# EasyEDA Pro project ProPrj_STM32音响_2025-06-08.epro, board First Test
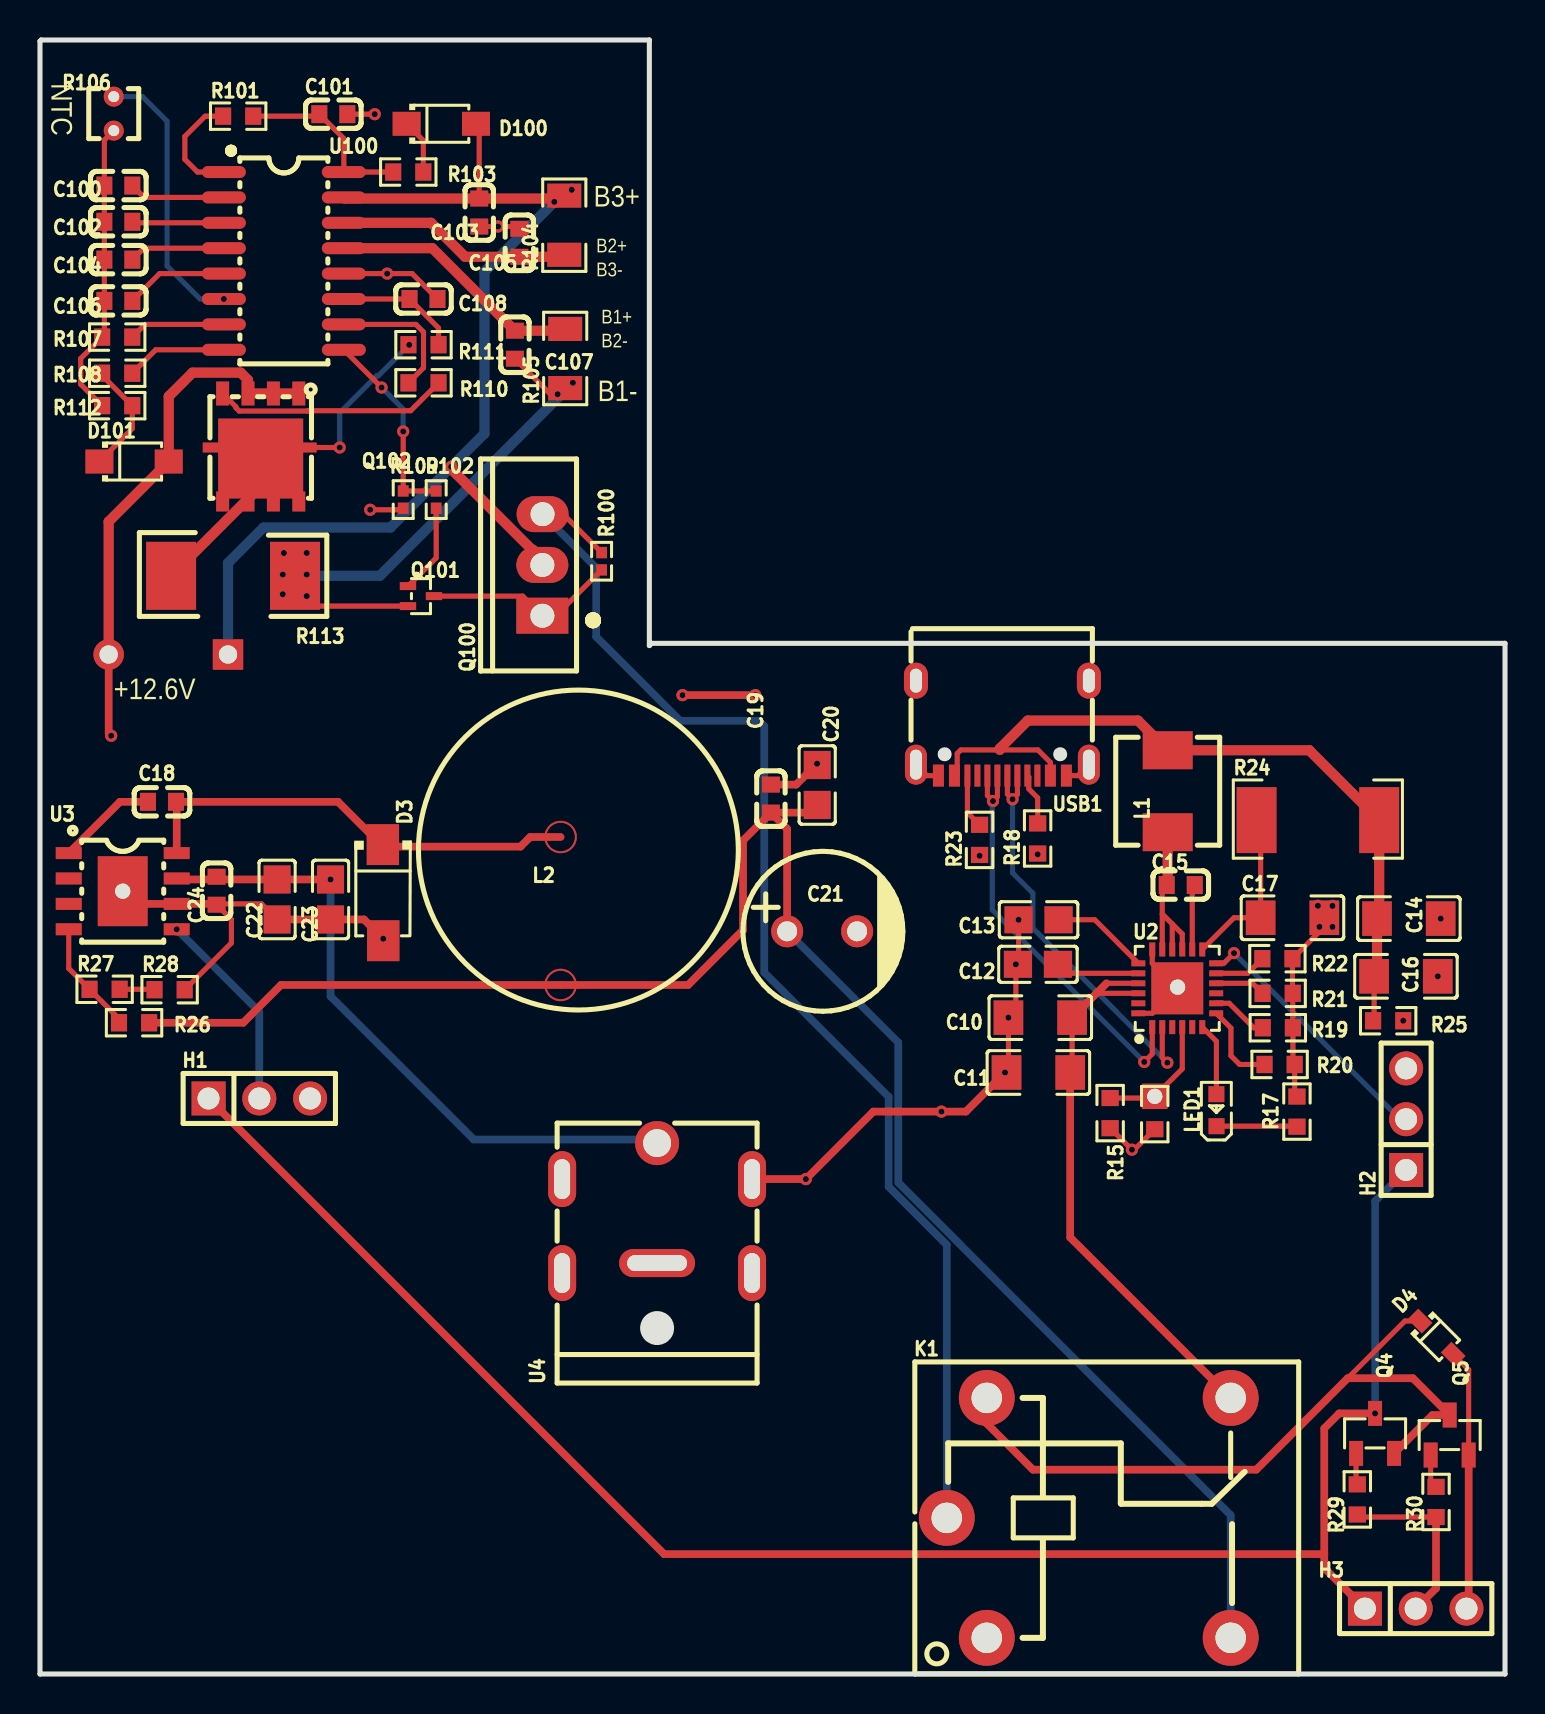
[diagram p15: board, top side]
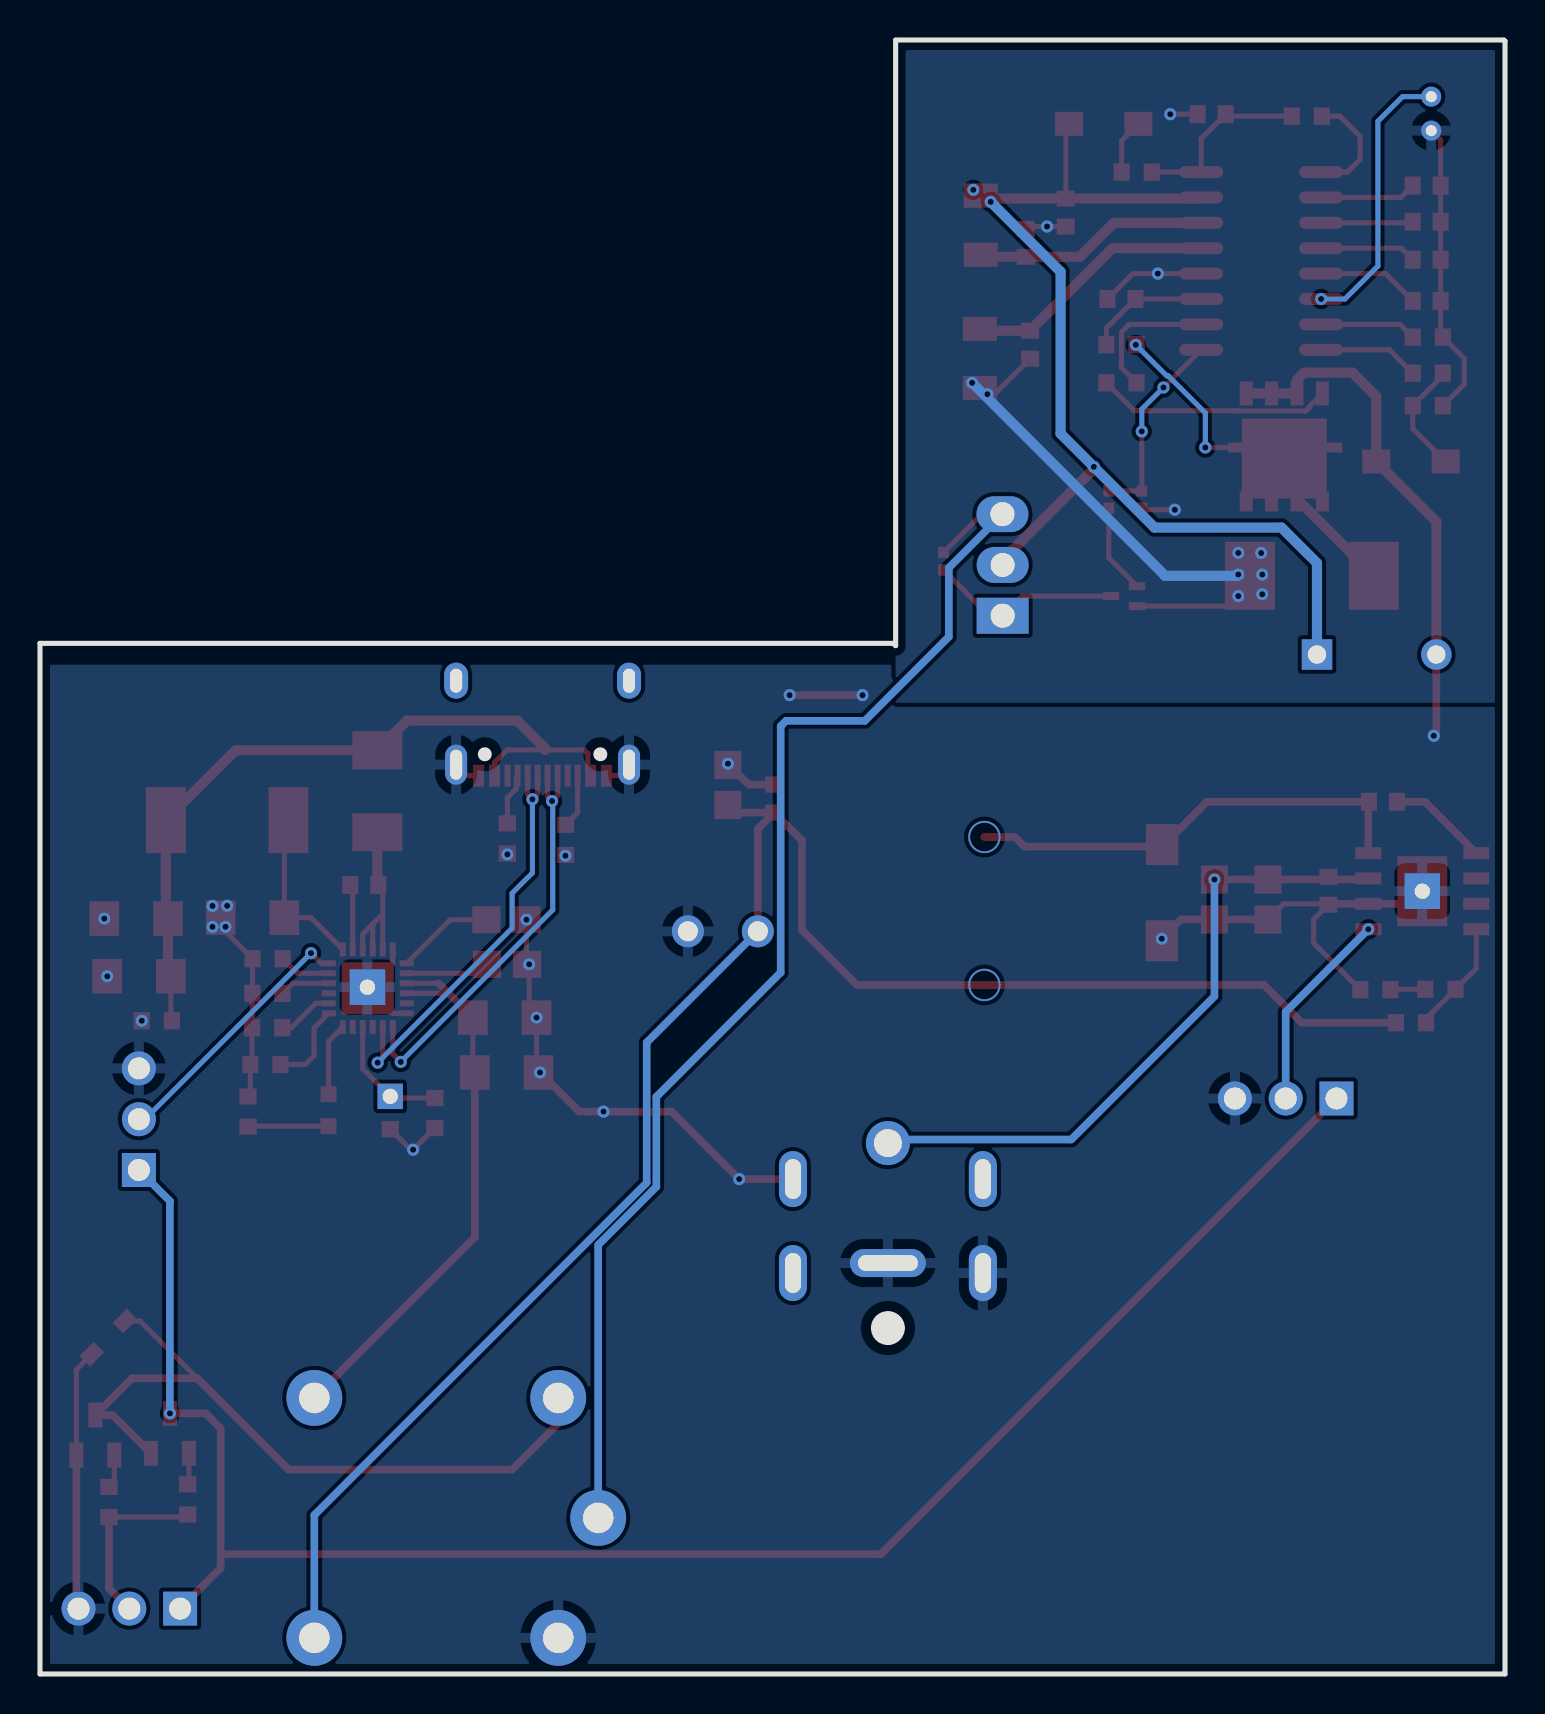
[diagram p16: board, bottom side, seen from below]

Outline 73.28 x 81.72 mm; copper layers: Top Layer, Bottom Layer. Coordinates in mm from the lower left corner of the outline.
Outline path: 0,81.66 0,0 73.28,0 73.28,51.55 30.59,51.55 30.48,51.44 30.48,81.72 0.06,81.72 0,81.66
Stack: Top Layer 0.035mm / Dielectric1 1.51mm FR4 er 4.5 / Bottom Layer 0.035mm

## Design rules (mm)
template: JLCPCB Capability(Two Layers Board)
spacing copperThickness1oz (default): track to track 0.102, other pairs 0.152 to 0.3
spacing copperThickness2oz: track to track 0.203, other pairs 0.152 to 0.3
track width copperThickness1oz (default): min 0.127, default 0.254, max 2.54
track width copperThickness2oz: min 0.203, default 0.254, max 2.54
differential pair differentialPair (default): width min 0.127, default 0.254, max 2.54; gap min 0.152, default 0.152
via viaSize (default): diameter min 0.5, default 0.61, max 10; hole min 0.3, default 0.305, max 6.3

## Placement (name value [footprint] x y rotation side)
C10  10uF  [C1206]  50.03 32.83 180 top
C11  10uF  [C1206]  49.94 30.08 180 top
C12  22uF  [C0805]  49.92 35.49 180 top
C13  22uF  [C0805]  49.95 37.72 180 top
C14  4.7uF  [C1206]  68.47 37.78 180 top
C15  100nF  [C0603]  57.06 39.46 180 top
C16  4.7uF  [C1206]  68.32 34.89 0 top
C17  10uF  [C1206]  62.65 37.82 0 top
C18  10nF  [C0603]  6.1 43.62 180 top
C19  10nF  [C0603]  36.56 43.78 90 top
C20  10uF  [C0805]  38.88 44.46 270 top
C21  100uF  [CAP-TH_BD8.0-P3.50-D0.6-FD]  39.12 37.14 0 top
C22  22uF  [C0805]  11.86 38.74 90 top
C23  22uF  [C0805]  14.53 38.74 90 top
C24  10nF  [C0603]  8.83 39.17 90 top
C100  100nF  [C0603]  3.92 74.44 0 top
C101  1uF  [C0603]  14.67 78.01 0 top
C102  100nF  [C0603]  3.92 72.63 0 top
C103  100nF  [C0603]  21.97 73.09 90 top
C104  100nF  [C0603]  3.92 70.74 0 top
C105  100nF  [C0603]  23.98 71.58 270 top
C106  100nF  [C0603]  3.92 68.67 0 top
C107  100nF  [C0603]  23.76 66.48 270 top
C108  10nF  [C0603]  19.18 68.77 180 top
D3  SS54  [SMA_L4.3-W2.6-LS5.0-RD]  17.16 39.08 270 top
D4  1N5819WS  [SOD-323_L1.8-W1.3-LS2.5-RD]  69.86 16.83 315 top
D100  1N4007W  [SOD-123FL_L2.7-W1.8-LS3.8-RD]  20.07 77.53 0 top
D101  1N4007W  [SOD-123FL_L2.7-W1.8-LS3.8-RD]  4.71 60.64 0 top
H1  PZ254V-11-03P  [HDR-TH_3P-P2.54-V-M]  10.97 28.78 0 top
H2  PZ254V-11-03P  [HDR-TH_3P-P2.54-V-M]  68.33 27.75 90 top
H3  PZ254V-11-03P  [HDR-TH_3P-P2.54-V-M]  68.81 3.27 0 top
K1  SRD-05VDC-SL-C  [RELAY-TH_SRD-XXVDC-XL-C]  52.46 7.81 0 top
L1  2.2uH  [IND-SMD_L5.4-W5.2_FXL0530]  56.41 44.15 90 top
L2  68uH  [68uH Inductor]  26.04 38.67 0 top
LED1  XL-1608SURC-06  [LED0603-RD_RED]  58.85 28.2 90 top
NOREF  -  [Pad_e204]  9.4 50.99 0 top
NOREF#2  -  [Pad_e855]  4.14 39.15 0 top
NOREF#3  -  [Pad_e537]  56.9 34.35 0 top
NOREF#4  -  [Pad_e205]  3.44 50.99 0 top
NOREF#5  -  [Pad_e363]  55.76 28.89 0 top
Q4  MMBT3904  [SOT-23-3_L2.9-W1.3-P1.90-LS2.4-BR]  66.78 12.03 270 top
Q5  MMBT3906LT1G  [SOT-23-3_L2.9-W1.3-P1.90-LS2.4-BR]  70.51 11.95 270 top
Q100  IRF9530NPBF  [TO-220-3_L10.0-W4.5-P2.54-L]  25.13 55.47 90 top
Q101  MMBT3904TT1G  [SC-75-3_L1.6-W0.8-P1.00-LS1.6-BR]  19.06 53.91 180 top
Q102  TPH2R306NH,L1Q  [DFN-8_L5.0-W5.0-P1.27-LS6.0-EP]  10.99 61.34 180 top
R15  82kΩ  [R0603]  53.53 28.05 90 top
R16  KNTC0603/100KF3950  [R0603]  55.76 28 90 top
R17  150Ω  [R0603]  62.87 28.13 270 top
R18  5.1kΩ  [R0603]  49.9 41.79 90 top
R19  120kΩ  [R0603]  61.92 32.32 180 top
R20  120kΩ  [R0603]  62 30.48 180 top
R21  1kΩ  [R0603]  61.91 34.04 180 top
R22  82kΩ  [R0603]  61.89 35.78 180 top
R23  5.1kΩ  [R0603]  47 41.72 90 top
R24  500mΩ  [RES-SMD_L6.4-W3.2-R2512]  63.92 42.71 0 top
R25  5.1kΩ  [R0603]  67.43 32.67 0 top
R26  10kΩ  [R0603]  4.71 32.57 0 top
R27  1kΩ  [R0603]  3.23 34.24 0 top
R28  75Ω  [R0603]  6.48 34.22 0 top
R29  1kΩ  [R0603]  65.89 8.73 90 top
R30  1kΩ  [R0603]  69.83 8.6 90 top
R100  4.7MΩ  [R0402]  28.09 55.65 270 top
R101  1MΩ  [R0603]  9.91 77.91 0 top
R102  4.7MΩ  [R0402]  19.82 58.73 270 top
R103  1kΩ  [R0603]  18.42 75.12 0 top
R104  0Ω  [R1206]  26.22 72.46 90 top
R105  0Ω  [R1206]  26.27 65.79 90 top
R106  MF52A103F3950 (A1)  [RES-TH_L2.5-W2.5-P1.70-D0.3]  3.69 78.04 90 top
R107  6.8kΩ  [R0603]  3.86 66.86 0 top
R108  220kΩ  [R0603]  3.86 65.06 0 top
R109  4.7MΩ  [R0402]  18.17 58.73 270 top
R110  2kΩ  [R0603]  19.18 64.58 180 top
R111  2kΩ  [R0603]  19.18 66.48 0 top
R112  10MΩ  [R0603]  3.86 63.43 180 top
R113  5mΩ  [RES-SMD_L6.4-W3.2-1]  9.66 54.92 180 top
U2  IP2326  [VQFN-24_L4.0-W4.0-P0.50-BL-EP2.5]  56.89 34.29 0 top
U3  TPS5450DDAR  [ESOP-8_L4.9-W3.9-P1.27-LS6.0-TL-EP]  4.14 39.15 0 top
U4  HX DC007B-2.5  [DC-IN-TH_HX-DC007B-2.5]  30.87 23.3 90 top
U100  -  [SOP-16_L10.3-W4.4-P1.27-LS7.0-BL]  12.2 70.67 270 top
USB1  TYPE-C 16PIN 2MD(073)  [USB-C-SMD_TYPE-C-6PIN-2MD-073]  48.14 47.31 180 top

## Footprints (pads in the part's own frame, mm; a bottom-side part is the same pattern mirrored in y, then rotated)
68uH Inductor
  custom 1.524x1.524 hole 0.914: 1(0,3.192) 2(0,-4.208)
C0603
  rect 0.8x0.9 smd: 1(-0.7,0) 2(0.7,0)
C0805
  rect 1.41x1.35 smd: 1(-1,0) 2(1,0)
C1206
  rect 1.485x1.728 smd: 1(-1.593,0) 2(1.593,0)
CAP-TH_BD8.0-P3.50-D0.6-FD
  round 1.6 hole 1: 1(-1.75,0) 2(1.75,0)
DC-IN-TH_HX-DC007B-2.5
  round 2.2 hole 1.4: 1(3.25,0)
  oval 1.4x3.8 hole 0.8x3: 2(-2.75,0)
  oval 2.8x1.4 hole 2x0.8: 3(-3.25,4.75) 3(-3.25,-4.75) 3(1.45,4.75) 3(1.45,-4.75)
DFN-8_L5.0-W5.0-P1.27-LS6.0-EP
  rect 0.65x1.2 smd: 1(-1.955,-2.7) 2(-0.685,-2.7) 3(0.585,-2.7) 4(1.855,-2.7)
  rect 0.65x1 smd: 5(1.855,2.7) 6(0.585,2.7) 7(-0.685,2.7) 8(-1.955,2.7)
  rect 1x0.5 smd: 8(-2.35,0.001) 8(2.35,0.001)
  rect 4.25x4 smd: 8(-0.05,0.55)
ESOP-8_L4.9-W3.9-P1.27-LS6.0-TL-EP
  rect 1.3x0.6 smd: 1(-2.7,1.905) 2(-2.7,0.635) 3(-2.7,-0.635) 4(-2.7,-1.905) 5(2.7,-1.905) 6(2.7,-0.635) 7(2.7,0.635) 8(2.7,1.905)
  rect 2.5x3.5 smd: 9(0,0)
HDR-TH_3P-P2.54-V-M
  rect 1.7x1.7 hole 1.1: 1(-2.54,0)
  round 1.7 hole 1.1: 2(0,0) 3(2.54,0)
IND-SMD_L5.4-W5.2_FXL0530
  rect 1.9x2.5 smd: 1(-2.05,0) 2(2.05,0)
LED0603-RD_RED
  rect 0.8x0.8 smd: 1(-0.799,-0.004) 2(0.799,0.004)
Pad_e204
  rect 1.524x1.524 hole 0.914: 1(0,0)
Pad_e205
  round 1.524 hole 0.914: 2(0,0)
Pad_e363
  rect 1.27x1.27 hole 0.762: 1(0,0)
Pad_e537
  rect 1.778x1.778 hole 0.762: 1(0,0)
Pad_e855
  rect 1.778x1.778 hole 0.762: 1(0,0)
R0402
  rect 0.566x0.54 smd: 1(-0.433,0) 2(0.433,0)
R0603
  rect 0.806x0.864 smd: 1(-0.753,0) 2(0.753,0)
R1206
  rect 1.208x1.701 smd: 1(-1.479,0) 2(1.479,0)
RELAY-TH_SRD-XXVDC-XL-C
  round 2.794 hole 1.524: 1(-5.1,-6) 2(7.1,-6) 3(7.1,6) 4(-5.1,6) 5(-7.1,0)
RES-SMD_L6.4-W3.2-1
  rect 2.5x3.4 smd: 1(-3.1,0) 2(3.1,0)
RES-SMD_L6.4-W3.2-R2512
  rect 2x3.3 smd: 1(-3.067,0) 2(3.067,0)
RES-TH_L2.5-W2.5-P1.70-D0.3
  round 1 hole 0.55: 1(-0.85,0) 2(0.85,0)
SC-75-3_L1.6-W0.8-P1.00-LS1.6-BR
  rect 0.816x0.4 smd: 1(0.65,-0.5) 2(0.65,0.5) 3(-0.65,0)
SMA_L4.3-W2.6-LS5.0-RD
  rect 2.046x1.62 smd: 1(-2.404,-0.009) 2(2.404,0.009)
SOD-123FL_L2.7-W1.8-LS3.8-RD
  rect 1.4x1.2 smd: 1(-1.735,0) 2(1.735,0)
SOD-323_L1.8-W1.3-LS2.5-RD
  rect 1x0.75 smd: 1(-1.173,0) 2(1.173,0)
SOP-16_L10.3-W4.4-P1.27-LS7.0-BL
  oval 0.6x2.2 smd: 1(-4.445,-3) 2(-3.175,-3) 3(-1.905,-3) 4(-0.635,-3) 5(0.635,-3) 6(1.905,-3) 7(3.175,-3) 8(4.445,-3) 9(4.445,3) 10(3.175,3) 11(1.905,3) 12(0.635,3) 13(-0.635,3) 14(-1.905,3) 15(-3.175,3) 16(-4.445,3)
SOT-23-3_L2.9-W1.3-P1.90-LS2.4-BR
  rect 1.25x0.7 smd: 1(1,-0.95) 2(1,0.95) 3(-1,0)
TO-220-3_L10.0-W4.5-P2.54-L
  rect 1.8x2.6 hole 1.2: 1(-2.54,0.005)
  oval 1.8x2.6 hole 1.2: 2(0,0.005) 3(2.54,-0.005)
USB-C-SMD_TYPE-C-6PIN-2MD-073
  rect 0.55x1.1 smd: 1(-3.2,2.375) 2(-2.4,2.375) 11(2.4,2.375) 12(3.2,2.375)
  rect 0.3x1.1 smd: 3(-1.75,2.375) 4(-1.25,2.375) 5(-0.75,2.375) 6(-0.25,2.375) 7(0.25,2.375) 8(0.75,2.375) 9(1.25,2.375) 10(1.75,2.375)
  oval 1.1x2 hole 0.6x1.5: 13(-4.325,1.825) 14(4.325,1.825)
  oval 1.2x1.8 hole 0.6x1.2: 13(-4.325,-2.375) 14(4.325,-2.375)
VQFN-24_L4.0-W4.0-P0.50-BL-EP2.5
  rect 0.3x0.7 smd: 1(-1.25,-1.942) 2(-0.75,-1.942) 3(-0.25,-1.942) 4(0.25,-1.942) 5(0.75,-1.942) 6(1.25,-1.942) 13(1.25,1.942) 14(0.75,1.942) 15(0.25,1.942) 16(-0.25,1.942) 17(-0.75,1.942) 18(-1.25,1.942)
  rect 0.7x0.3 smd: 7(1.948,-1.25) 8(1.948,-0.75) 9(1.948,-0.25) 10(1.948,0.25) 11(1.948,0.75) 12(1.948,1.25) 19(-1.948,1.25) 20(-1.948,0.75) 21(-1.948,0.25) 22(-1.948,-0.25) 23(-1.948,-0.75) 24(-1.948,-1.25)
  rect 2.6x2.6 smd: 25(0.001,-0.001)

## Nets
As in the schematic, except:
GND: C10.2 C11.2 C12.2 C13.2 C14.1 C16.2 C17.2 C19.2 C20.1 C21.2 C22.1 C23.1 C24.1 D3.2 D4.2 D101.2 H1.3 H2.3 H3.3 K1.1 NOREF#2.1 NOREF#3.1 NOREF#4.2 Q5.2 Q102.1 Q102.2 Q102.3 R15.1 R16.1 R17.1 R18.1 R19.1 R20.1 R21.1 R22.1 R23.1 R25.2 R28.2 U2.18 U2.24 U2.25 U3.6 U3.9 U4.2 U4.3 USB1.1 USB1.12 USB1.13 USB1.14
BAT+: C103.2 D100.2 NOREF.1 Q100.2 R104.2 U100.15
$1N1199: Q102.5 Q102.6 Q102.7 Q102.8 R111.1 R113.2
$2N1168: NOREF#5.1 R15.2 R16.2 U2.4

Pads without a net: U2 3 9 23; U3 2 3; USB1 3 9

## Via types
v1: diameter 0.61, hole 0.305, Top Layer to Bottom Layer, 49 vias

## Routing (per net, layer and track width the routed paths; a pad name or vN(x,y) marks a point on that pad's centre or on a via; arc(x,y) is an arc through that point)
+5V_A: length 90.8
  Top Layer w0.381: H1.1 31.22,6 64.24,6 ; H3.1 64.24,5.3 64.24,6 ; 64.24,6 64.24,12.29 64.99,13.03 v1(66.78,13.03)
  Bottom Layer w0.381: H2.1 66.78,23.65 v1(66.78,13.03)
+12.6V_1: length 91.4
  Top Layer w0.381: 5.46,32.57 10.17,32.57 12.05,34.46 L2.2 32.42,34.46 35.17,37.21 35.17,41.69 C19.1 ; C20.2 38.49,43.08 C19.1 ; C19.1 37.37,42.27 C21.1
  Bottom Layer w0.381: K1.2 59.56,7.95 42.93,24.57 42.93,31.58 C21.1
+12.6V_2: length 28.5
  Top Layer w0.254: 54.94,34.04 52.84,34.04 ; 51.63,32.83 51.63,30.18 C11.1 ; 54.94,34.54 53.34,34.54
  Top Layer w0.381: 51.63,32.83 53.34,34.54 ; 59.56,13.81 51.53,21.83 C11.1
+24V: length 32.7
  Top Layer w0.381: v1(14.53,39.74) C22.2 6.89,39.74 U3.7
  Bottom Layer w0.381: 30.67,26.73 21.7,26.73 14.53,33.89 v1(14.53,39.74)
GND: length 108.4
  Top Layer w0.254: D4.2 71.46,15.22 Q5.2 ; v1(48.81,35.49) 48.81,33.2 v1(48.44,32.83) 48.44,30.18 C11.2 ; v1(48.95,37.72) 48.95,35.52 C12.2 ; U2.18 55.64,35.54 U2.25 55.64,33.04 54.94,33.04 ; USB1.12 44.36,44.93 USB1.14 ; C22.1 11.08,38.52 8.79,38.52 9.57,37.74 9.57,36.56 R28.2 ; R16.1 54.73,26.22 v1(54.62,26.22) 53.54,27.3 R15.1 ; R17.1 62.76,29 R20.1 62.67,30.57 R19.1 62.66,32.33 R21.1 62.65,34.05 R22.1 64.24,37.37 C17.2 ; USB1.1 51.91,44.93 USB1.13
  Top Layer w0.381: v1(32.14,48.96) v1(35.78,48.96) ; NOREF#4.2 3.44,47.05 v1(3.56,46.92) ; C19.2 37.82,44.48 v1(38.87,45.53) ; v1(17.17,36.77) 16.21,37.74 C23.1 C22.1 ; U3.9 4.77,38.52 U3.6 8.79,38.52 C24.1 ; Q5.2 71.46,3.38 H3.3 ; v1(48.27,30.08) 46.31,28.13 v1(45.09,28.13) 41.68,28.13 v1(38.31,24.75) U4.3
  Top Layer w0.508: Q102.1 Q102.2 10.41,64.04 10.41,64.72 10.04,65.09 7.63,65.09 6.44,63.9 D101.2 3.44,57.63 NOREF#4.2
  vias: v1(47,40.92) v1(49.9,40.99) v1(63.92,38.42) v1(64,37.37) v1(64.65,38.42) v1(64.65,37.37) v1(68.19,32.67) v1(69.92,34.89) v1(70.06,37.78)
BAT1+: length 12.8
  Top Layer w0.508: U100.13 19.63,71.31 C107.1 26.18,67.18 R105.2
BAT1-: length 50.7
  Top Layer w0.254: Q101.2 13.84,53.41 v1(13.34,53.91) ; R106.1 3.22,76.72 C100.1 C102.1 C104.1 C106.1 3.22,66.97 R107.1 2.04,65.79 2.04,64.5 R112.2 ; C103.1 v1(22.91,72.39) 23.86,72.39 C105.1 ; v1(16.52,58.23) 18.09,58.23 R109.2 ; v1(25.89,64.01) 25.53,64.01 C107.2 ; U100.12 v1(17.37,70.04) 18.61,70.04 C108.1 ; C101.2 v1(16.74,78.01)
  Bottom Layer w0.508: v1(13.34,54.99) 13.4,54.92 17,54.92 v1(26.65,64.58)
  vias: v1(12.2,56.06) v1(12.14,54.99) v1(12.14,54) v1(13.34,56.07)
BAT2+: length 11.8
  Top Layer w0.508: U100.14 19.56,72.58 21.26,70.88 C105.2 26.12,70.88 R104.1
BAT+: length 54.7
  Top Layer w0.254: C103.2 21.97,77.37 D100.2
  Top Layer w0.508: U100.15 15.25,73.79 C103.2 26.08,73.79 R104.2 ; Q100.2 25.13,55.76 24.66,56.23 24.61,56.23 20.58,60.26
  Bottom Layer w0.508: v1(25.72,73.63) 22.23,70.13 22.23,62.04 v1(20.57,60.37) 17.53,57.34 11.18,57.34 9.4,55.56 NOREF.1
  vias: v1(26.6,74.23)
CHARGE+: length 64.6
  Top Layer w0.254: R100.1 26.17,58.01 Q100.3
  Bottom Layer w0.381: K1.5 45.36,21.46 42.45,24.37 42.45,28.86 36.23,35.08 36.23,47.4 35.96,47.67 32.02,47.67 27.82,51.88 27.82,55.33 Q100.3
CRL1: length 9
  Top Layer w0.254: R29.1 66.02,7.85 R30.1
  Top Layer w0.381: R30.1 69.83,4.29 H3.2
DM: length 20.9
  Top Layer w0.254: v1(55.23,30.61) 55.64,31.01 U2.1 ; USB1.7 47.89,43.88 v1(47.67,43.66) 47.39,43.94 USB1.8
  Bottom Layer w0.254: v1(55.23,30.61) 47.63,38.21 47.63,43.62 v1(47.67,43.66)
DP: length 20.7
  Top Layer w0.254: USB1.5 48.89,43.99 v1(48.65,43.75) 48.39,44.01 USB1.6 ; 56.14,32.23 56.14,30.83 v1(56.39,30.57)
  Bottom Layer w0.254: v1(48.65,43.75) 48.65,40.07 49.66,39.05 49.66,37.3 v1(56.39,30.57)
EN_2326: length 13.1
  Top Layer w0.254: v1(59.72,36.05) 59.21,35.54 U2.12
  Bottom Layer w0.254: v1(59.72,36.05) 68.03,27.75 H2.2
EN_5430_1: length 10.2
  Bottom Layer w0.381: v1(6.84,37.25) 10.97,33.11 H1.2
$1N1192: length 9.2
  Top Layer w0.254: R101.2 13.87,77.91 C101.1 15.2,76.79 U100.16 R103.1
$1N1194: length 9.7
  Top Layer w0.254: 19.71,53.91 24.15,53.91 Q100.1 25.8,52.93 R100.2
$1N1199: length 16
  Top Layer w0.254: 13.34,61.34 v1(14.99,61.34)
  Top Layer w0.508: R113.2 11.04,59.41 Q102.8
  Bottom Layer w0.254: v1(14.99,61.34) 14.99,63.07 16.84,64.92 16.92,64.92 v1(18.47,66.48)
$1N1201: length 6.2
  Top Layer w0.254: R111.2 19.94,67.31 C108.2 U100.11
$1N1202: length 7
  Top Layer w0.254: U100.10 18.8,67.5 19.18,67.12 19.18,65.33 R110.2
$1N1203: length 11.8
  Top Layer w0.254: Q102.4 9.8,63.38 9.8,63.33 9.96,63.16 13.39,63.16 13.4,63.18 18.54,63.18 R110.1
$1N1205: length 2.8
  Top Layer w0.254: 19.17,75.12 19.17,76.69 D100.1
$1N1206: length 9.9
  Top Layer w0.254: R102.1 R109.1 v1(18.17,62.14) ; U100.9 v1(17.08,64.34)
  Bottom Layer w0.254: v1(18.17,62.14) 18.17,63.26 v1(17.08,64.34)
$1N1208: length 4.5
  Top Layer w0.254: Q101.1 19.82,55.82 R102.2
$1N1209: length 5.7
  Top Layer w0.254: R108.1 3.11,64.94 R112.1 4.62,62.29 D101.1
$1N1210: length 4.8
  Top Layer w0.254: U100.4 5.19,71.31 C104.2
$1N1211: length 4.8
  Top Layer w0.254: U100.2 5.21,73.85 C100.2
$1N1212: length 5.7
  Top Layer w0.254: R101.1 8.26,77.91 7.25,76.9 7.25,75.75 7.88,75.12 U100.1
$1N1213: length 4.6
  Top Layer w0.254: C102.2 4.67,72.58 U100.3
$1N1214: length 13.9
  Bottom Layer w0.254: R106.2 5.13,78.89 6.36,77.66 6.36,70.42 8.01,68.77 v1(9.2,68.77)
$1N1215: length 5.1
  Top Layer w0.254: C106.2 5.98,70.04 U100.5
$1N1216: length 5.1
  Top Layer w0.254: U100.8 5.79,66.23 R108.2
$1N1217: length 4.8
  Top Layer w0.254: U100.7 5.25,67.5 R107.2
$2N1143: length 9.4
  Top Layer w0.254: U2.16 56.64,37.51 ; 56.64,37.51 56.14,38.01 ; 56.64,37.51 57.14,37.01 U2.15 ; 56.14,38.01 U2.17 ; 56.14,38.01 56.14,39.23 C15.2
  Top Layer w0.508: C15.2 56.41,39.51 L1.1
$2N1144: length 38.7
  Top Layer w0.254: USB1.2 50.54,45.59 49.92,46.21 46.06,46.21 45.88,46.03 45.88,45.07 USB1.11 ; R25.1 66.73,32.72 C16.1
  Top Layer w0.508: C16.1 66.88,35.04 C14.2 66.98,37.89 R24.2 63.49,46.2 L1.2 54.92,47.69 49.41,47.69 48.01,46.29 48.01,46.21
$2N1146: length 3.3
  Top Layer w0.254: U2.14 57.64,39.33 C15.1
$2N1148: length 8.5
  Top Layer w0.254: R24.1 61.06,42.5 C17.1 59.72,37.82 U2.13
$2N1151: length 2.6
  Top Layer w0.254: R18.2 49.9,43.82 49.46,44.26 49.46,44.86 49.39,44.93
$2N1152: length 2.7
  Top Layer w0.254: R23.2 46.39,43.08 46.39,44.93
$2N1157: length 4.2
  Top Layer w0.254: 54.94,35.04 51.37,35.04 C12.1
$2N1158: length 4.9
  Top Layer w0.254: 54.94,35.54 52.76,37.72 C13.1
$2N1168: length 6.3
  Top Layer w0.254: R15.2 55.68,28.81 NOREF#5.1 57.14,30.27 U2.4
$2N1171: length 4.3
  Top Layer w0.254: 61.25,30.48 60.01,30.48 59.57,30.92 59.57,32.31 U2.7
$2N1172: length 3.6
  Top Layer w0.254: LED1.2 58.84,31.64 U2.6
$2N1173: length 4
  Top Layer w0.254: LED1.1 62.85,27.4 R17.2
$2N1174: length 2.6
  Top Layer w0.254: R22.2 60.41,35.04 U2.11
$2N1179: length 2.5
  Top Layer w0.254: U2.10 60.65,34.54 R21.2
$2N1180: length 2.8
  Top Layer w0.254: R19.2 60.71,32.32 59.49,33.54 U2.8
$2N1727: length 5
  Top Layer w0.381: C18.2 4,43.62 U3.1
$2N1728: length 22.9
  Top Layer w0.381: U3.8 6.84,43.59 C18.1 14.91,43.62 17.15,41.38 24.04,41.38 24.52,41.86 L2.1
$2N1732: length 5.7
  Top Layer w0.254: U3.4 1.44,35.29 R27.1 3.95,32.77 R26.1
$2N1736: length 1.8
  Top Layer w0.254: R28.1 5.71,34.24 R27.2
$2N2052: length 1.6
  Top Layer w0.254: R29.2 65.83,9.55 Q4.1
$2N2053: length 1.7
  Top Layer w0.254: R30.2 69.56,9.62 69.56,10.95
$2N2055: length 36.4
  Top Layer w0.254: D4.1 68.27,17.65 65.41,14.79
  Top Layer w0.381: K1.4 47.36,12.53 49.66,10.22 60.84,10.22 65.41,14.79 68.67,14.79 Q5.3 69.65,12.95 Q4.2

## Copper pours and planes (outline as drawn; the poured copper is in the pictures)
GND on Bottom Layer: 0.13,50.48 73.29,50.48 73.29,0.06 0.13,0.06
BAT1- on Bottom Layer: 0.01,81.72 30.49,81.72 30.49,48.58 0.01,48.58

## Text on the board
Top Silkscreen Layer: B2+ / B3- | B1+ / B2- | +12.6V | B3+ | B1- | NTC
